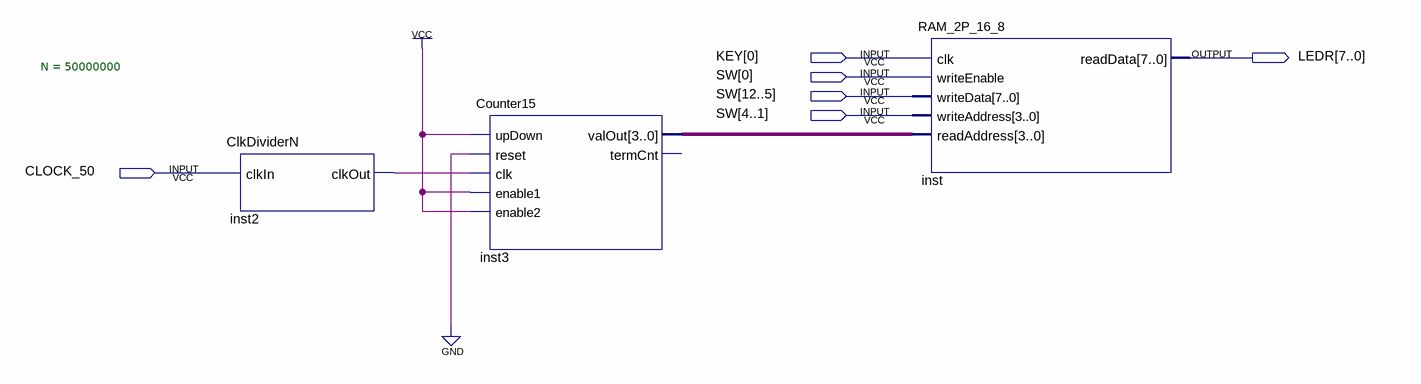
[diagram p0: schematic sheet]
// Quartus schematic RAM_2P_Demo.bdf as structural Verilog: 3 symbols, 6 pins
module RAM_2P_Demo (
  input  [0:0] KEY,
  input  [12:0] SW,
  input  CLOCK_50,
  output [7:0] LEDR
);

  wire inst2_clkout;
  wire [3:0] inst3_valout;

  ClkDividerN #(.N(50000000)) inst2 (.clkIn(CLOCK_50), .clkOut(inst2_clkout));
  Counter15 inst3 (
    .upDown(1'b1), .reset(1'b0), .clk(inst2_clkout), .enable1(1'b1), .enable2(1'b1), .valOut(inst3_valout));  // open: termCnt
  RAM_2P_16_8 inst (
    .clk(KEY[0]), .writeEnable(SW[0]), .writeData(SW[12:5]), .writeAddress(SW[4:1]),
    .readAddress(inst3_valout), .readData(LEDR));
endmodule
